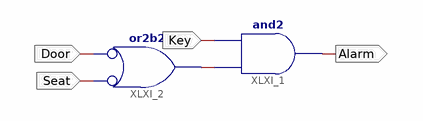
[diagram p0: schematic sheet 1]
// Xilinx ISE schematic Car_Alarm.sch (spartan3e) as structural Verilog: 2 symbols, 4 ports
module Car_Alarm (
  input  Door,
  input  Seat,
  input  Key,
  output Alarm
);

  wire XLXN_1;

  and XLXI_1 (Alarm, XLXN_1, Key);
  or XLXI_2 (XLXN_1, ~Seat, ~Door);  // or2b2
endmodule
